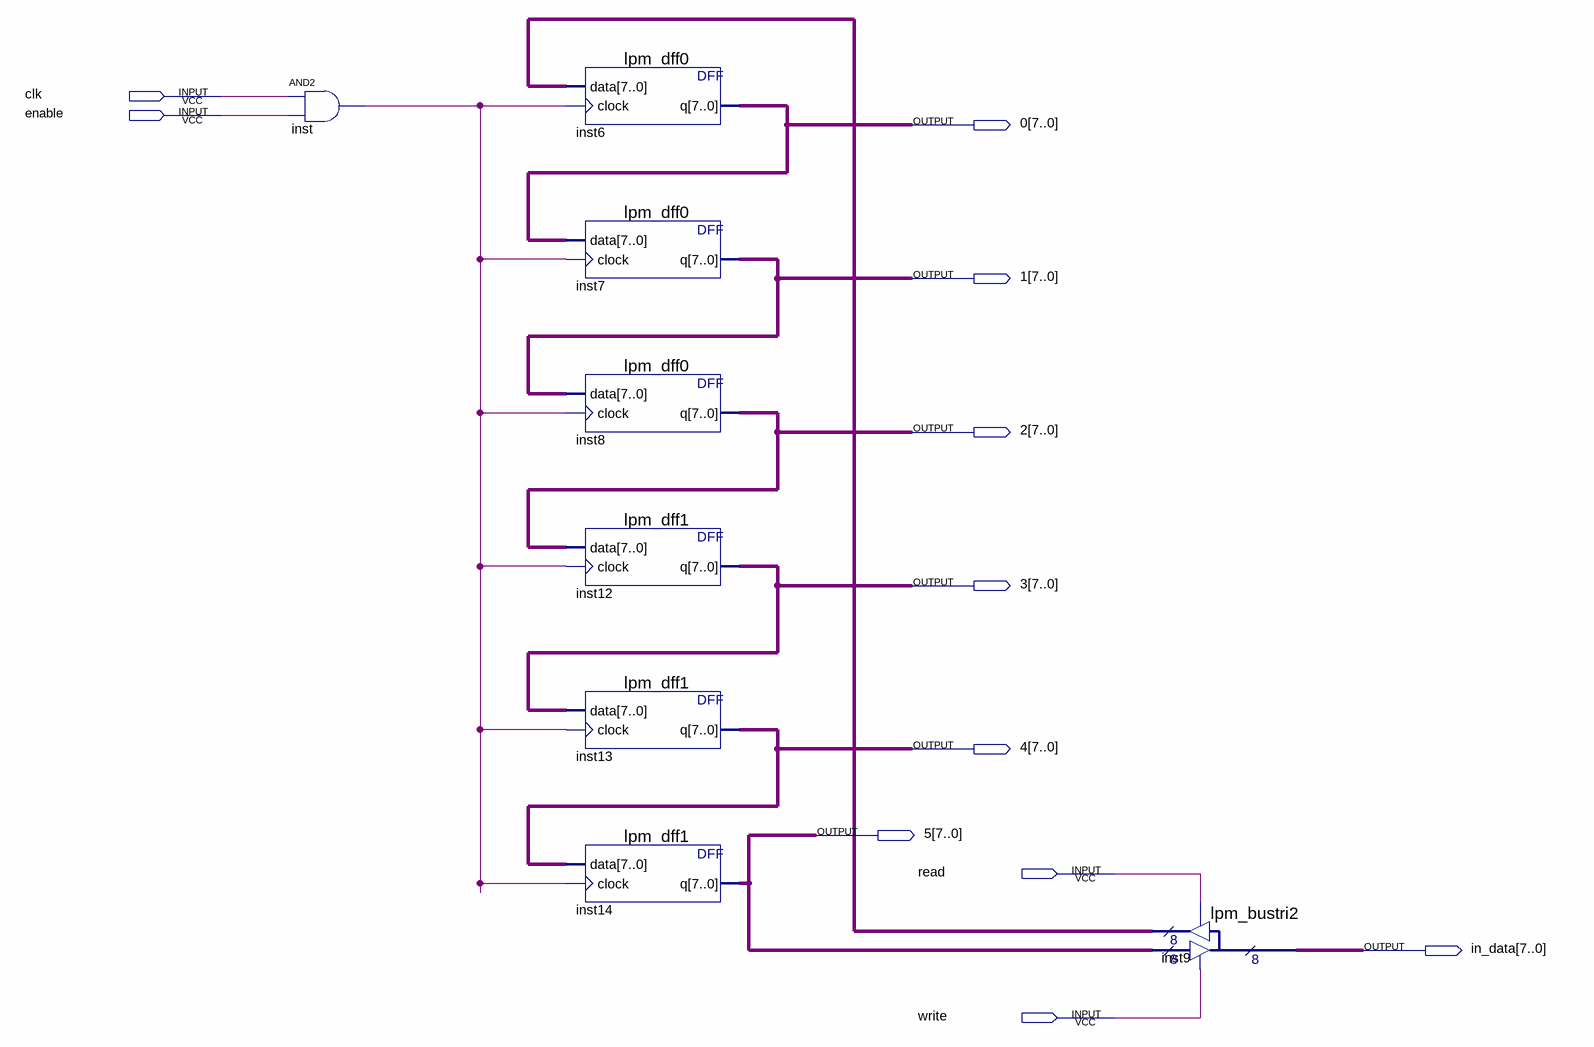
[diagram p0: schematic sheet]
// Quartus schematic buffer.bdf as structural Verilog: 8 symbols, 11 pins
module buffer (
  input  clk,
  input  enable,
  input  read,
  input  write,
  output [7:0] \0 ,
  output [7:0] \1 ,
  output [7:0] \2 ,
  output [7:0] \3 ,
  output [7:0] \4 ,
  output [7:0] \5 ,
  output [7:0] in_data
);

  wire inst_out;
  wire [7:0] inst9_result;

  and inst (inst_out, clk, enable);
  lpm_dff0 inst6 (.data(inst9_result), .clock(inst_out), .q(\0 ));
  lpm_dff0 inst7 (.data(\0 ), .clock(inst_out), .q(\1 ));
  lpm_dff0 inst8 (.data(\1 ), .clock(inst_out), .q(\2 ));
  lpm_dff1 inst12 (.data(\2 ), .clock(inst_out), .q(\3 ));
  lpm_dff1 inst13 (.data(\3 ), .clock(inst_out), .q(\4 ));
  lpm_dff1 inst14 (.data(\4 ), .clock(inst_out), .q(\5 ));
  lpm_bustri2 inst9 (.enabledt(write), .data(\5 ), .enabletr(read), .result(inst9_result), .tridata(in_data));
endmodule
